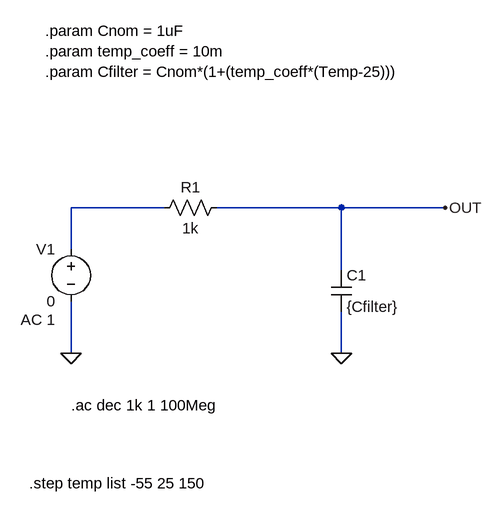
[diagram p0: schematic RC_Filter_Example_with_Temperature_Dependent_Cap.asc]
RC_Filter_Example_with_Temperature_Dependent_Cap.asc, the LTspice schematic file:
Version 4
SHEET 1 880 680
WIRE 96 160 -48 160
WIRE 368 160 176 160
WIRE 528 160 368 160
WIRE -48 224 -48 160
WIRE 368 256 368 160
WIRE -48 384 -48 304
WIRE 368 384 368 320
FLAG 368 384 0
FLAG -48 384 0
FLAG 528 160 OUT
SYMBOL cap 352 256 R0
SYMATTR InstName C1
SYMATTR Value {Cfilter}
SYMBOL res 80 176 R270
WINDOW 0 32 56 VTop 2
WINDOW 3 0 56 VBottom 2
SYMATTR InstName R1
SYMATTR Value 1k
SYMBOL voltage -48 208 M0
WINDOW 123 24 124 Left 2
WINDOW 39 0 0 Left 0
SYMATTR InstName V1
SYMATTR Value 0
SYMATTR Value2 AC 1
TEXT -88 -112 Left 2 !.param Cnom = 1uF\n.param temp_coeff = 10m\n.param Cfilter = Cnom*(1+(temp_coeff*(Temp-25)))
TEXT -48 464 Left 2 !.ac dec 1k 1 100Meg
TEXT -112 584 Left 2 !.step temp list -55 25 150

The netlist it stands for:
* RC_Filter_Example_with_Temperature_Dependent_Cap.asc
C1 OUT 0 {Cfilter}
R1 N001 OUT 1k
V1 N001 0 0 AC 1
.param Cnom = 1uF
.param temp_coeff = 10m
.param Cfilter = Cnom*(1+(temp_coeff*(Temp-25)))
.ac dec 1k 1 100Meg
.step temp list -55 25 150
.backanno
.end

* Results of the author's LTspice run, read from the files saved beside the schematic
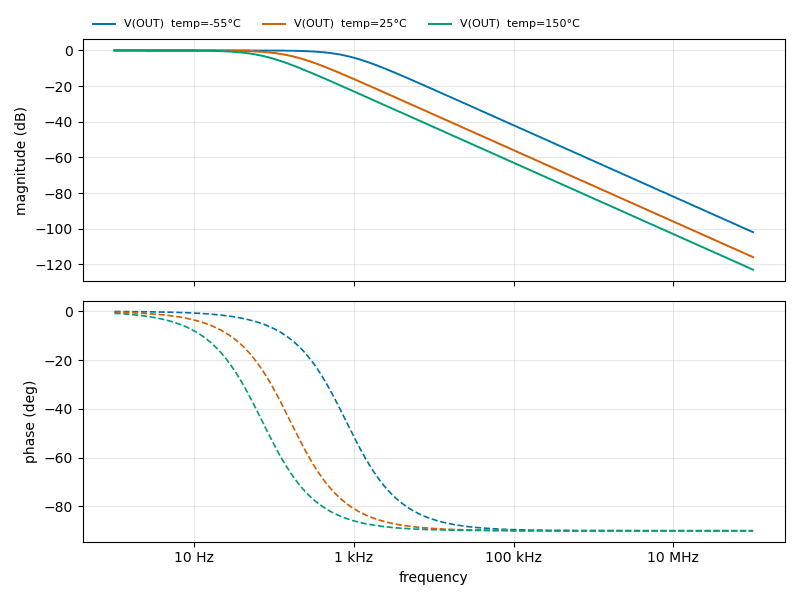
[diagram p1: AC Analysis of RC_Filter_Example_with_Temperature_Dependent_Cap.asc, plotted from the saved traces]
* AC Analysis, 3 runs:
*   V(OUT) [temp=-55°C]: -0.00 dB at 1 Hz, -101.98 dB at 100 MHz, peak -0.00 dB at 1 Hz, 3 dB below the peak at 795.8 Hz
*   V(OUT) [temp=25°C]: -0.00 dB at 1 Hz, -115.96 dB at 100 MHz, peak -0.00 dB at 1 Hz, 3 dB below the peak at 159.2 Hz
*   V(OUT) [temp=150°C]: -0.00 dB at 1 Hz, -123.01 dB at 100 MHz, peak -0.00 dB at 1 Hz, 3 dB below the peak at 70.75 Hz